# Altium schematic sheet FMC_Clocks.SchDoc
size A4; DocumentNumber: 27; SheetNumber: 27; SheetTotal: 30
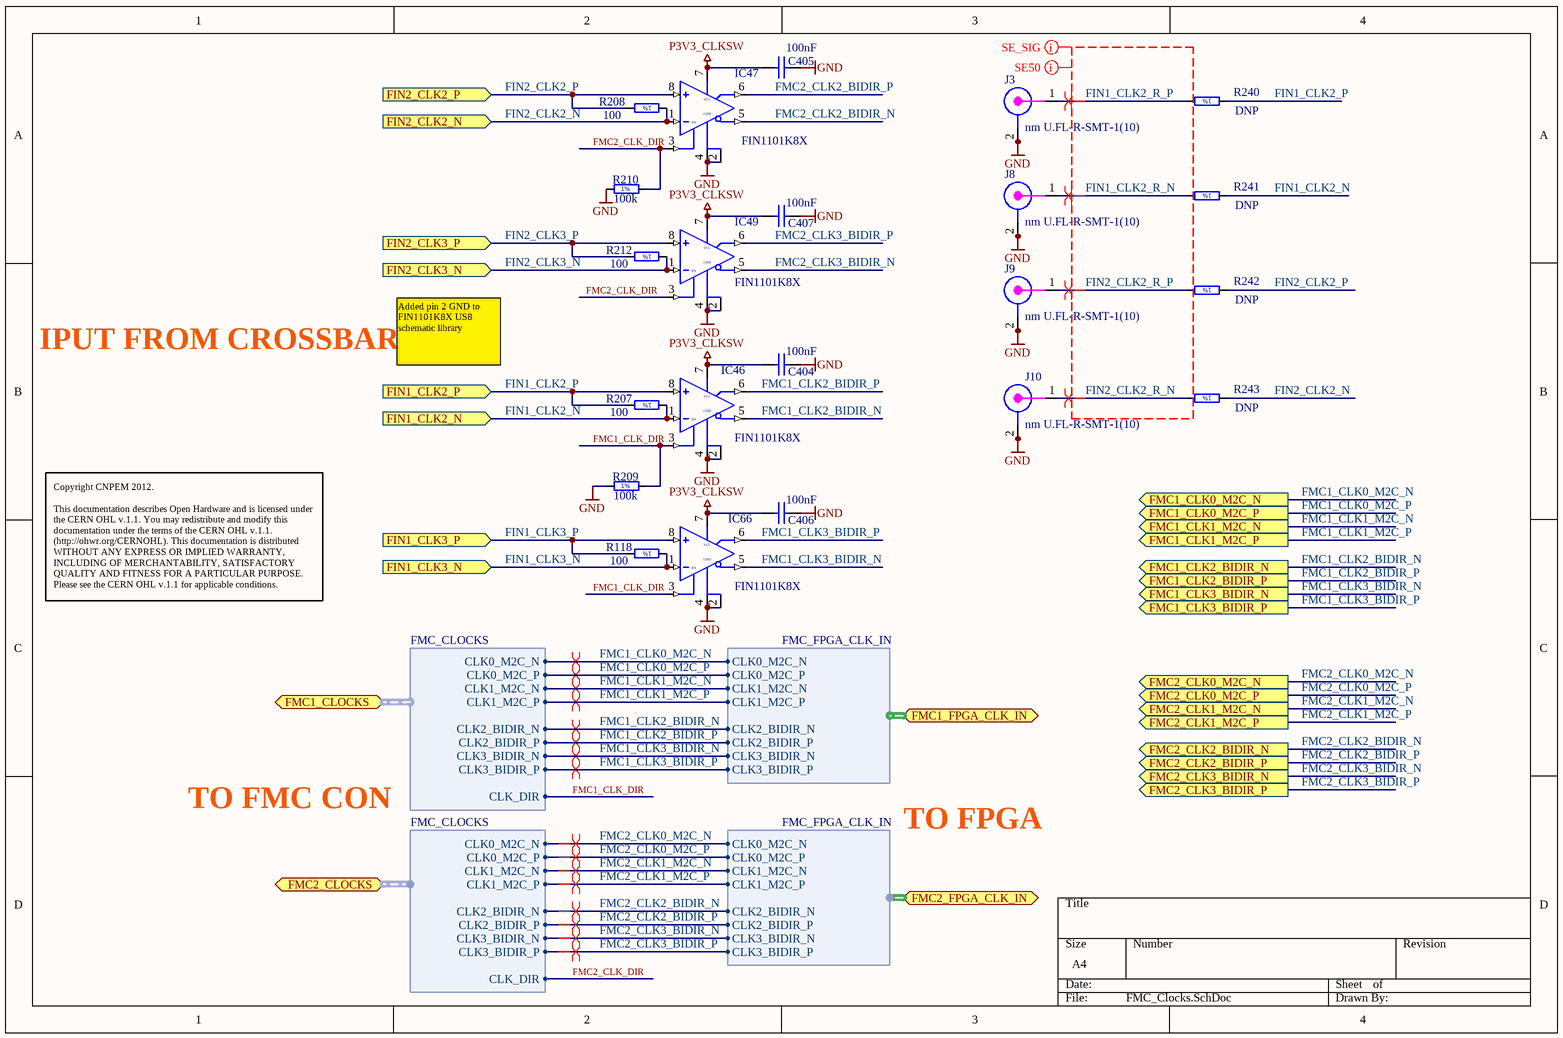
[diagram p0: FMC_Clocks.SchDoc]

## Parts
C404  100nF  [CAPC0603X33N]
C405  100nF  [CAPC0603X33N]
C406  100nF  [CAPC0603X33N]
C407  100nF  [CAPC0603X33N]
IC46  FIN1101K8X  [US8]
IC47  FIN1101K8X  [US8]
IC49  FIN1101K8X  [US8]
IC66  FIN1101K8X  [US8]
J3  nm U.FL-R-SMT-1(10)  [CON_UFL_HIROSE_RECEPTACLE]
J8  nm U.FL-R-SMT-1(10)  [CON_UFL_HIROSE_RECEPTACLE]
J9  nm U.FL-R-SMT-1(10)  [CON_UFL_HIROSE_RECEPTACLE]
J10  nm U.FL-R-SMT-1(10)  [CON_UFL_HIROSE_RECEPTACLE]
R118  100  [RESC1005X40N]
R207  100  [RESC1005X40N]
R208  100  [RESC1005X40N]
R209  100k  [RESC1005X40N]
R210  100k  [RESC1005X40N]
R212  100  [RESC1005X40N]
R240  DNP  [RESC1005X40N]
R241  DNP  [RESC1005X40N]
R242  DNP  [RESC1005X40N]
R243  DNP  [RESC1005X40N]

## Ports
FIN1_CLK2_N (in), FIN1_CLK2_P (in), FIN1_CLK3_N (in), FIN1_CLK3_P (in), FIN2_CLK2_N (in), FIN2_CLK2_P (in), FIN2_CLK3_N (in), FIN2_CLK3_P (in), FMC1_CLK0_M2C_N (out), FMC1_CLK0_M2C_P (out), FMC1_CLK1_M2C_N (out), FMC1_CLK1_M2C_P (out), FMC1_CLK2_BIDIR_N (out), FMC1_CLK2_BIDIR_P (out), FMC1_CLK3_BIDIR_N (out), FMC1_CLK3_BIDIR_P (out), FMC1_CLOCKS (harness FMC_CLOCKS), FMC1_FPGA_CLK_IN (harness FMC_FPGA_CLK_IN), FMC2_CLK0_M2C_N (out), FMC2_CLK0_M2C_P (out), FMC2_CLK1_M2C_N (out), FMC2_CLK1_M2C_P (out), FMC2_CLK2_BIDIR_N (out), FMC2_CLK2_BIDIR_P (out), FMC2_CLK3_BIDIR_N (out), FMC2_CLK3_BIDIR_P (out), FMC2_CLOCKS (harness FMC_CLOCKS), FMC2_FPGA_CLK_IN (harness FMC_FPGA_CLK_IN)

## Harnesses
FMC_CLOCKS: CLK0_M2C_N, CLK0_M2C_P, CLK1_M2C_N, CLK1_M2C_P, CLK_DIR, CLK2_BIDIR_N, CLK2_BIDIR_P, CLK3_BIDIR_N, CLK3_BIDIR_P
FMC_FPGA_CLK_IN: CLK0_M2C_N, CLK0_M2C_P, CLK1_M2C_N, CLK1_M2C_P, CLK2_BIDIR_N, CLK2_BIDIR_P, CLK3_BIDIR_N, CLK3_BIDIR_P

## Nets
GND: C404.2 C405.2 C406.2 C407.2 IC46.2(GND) IC46.4(GND) IC47.2(GND) IC47.4(GND) IC49.2(GND) IC49.4(GND) IC66.2(GND) IC66.4(GND) J3.2 J3.2a(GND) J8.2 J8.2a(GND) J9.2 J9.2a(GND) J10.2 J10.2a(GND) R209.1 R210.1
P3V3_CLKSW: C404.1 C405.1 C406.1 C407.1 IC46.7(VCC) IC47.7(VCC) IC49.7(VCC) IC66.7(VCC)
FIN1_CLK2_N: IC46.1(IN) R207.1 R241.1 ; port FIN1_CLK2_N
FIN1_CLK2_P: IC46.8(IN) R207.2 R240.1 ; port FIN1_CLK2_P
FIN1_CLK2_R_N: J8.1 R241.2
FIN1_CLK2_R_P: J3.1 R240.2
FIN1_CLK3_N: IC66.1(IN) R118.1 ; port FIN1_CLK3_N
FIN1_CLK3_P: IC66.8(IN) R118.2 ; port FIN1_CLK3_P
FIN2_CLK2_N: IC47.1(IN) R208.1 R243.1 ; port FIN2_CLK2_N
FIN2_CLK2_P: IC47.8(IN) R208.2 R242.1 ; port FIN2_CLK2_P
FIN2_CLK2_R_N: J10.1 R243.2
FIN2_CLK2_R_P: J9.1 R242.2
FIN2_CLK3_N: IC49.1(IN) R212.1 ; port FIN2_CLK3_N
FIN2_CLK3_P: IC49.8(IN) R212.2 ; port FIN2_CLK3_P
FMC1_CLK0_M2C_N: port FMC1_CLK0_M2C_N, port FMC1_CLOCKS.CLK0_M2C_N, port FMC1_FPGA_CLK_IN.CLK0_M2C_N
FMC1_CLK0_M2C_P: port FMC1_CLK0_M2C_P, port FMC1_CLOCKS.CLK0_M2C_P, port FMC1_FPGA_CLK_IN.CLK0_M2C_P
FMC1_CLK1_M2C_N: port FMC1_CLK1_M2C_N, port FMC1_CLOCKS.CLK1_M2C_N, port FMC1_FPGA_CLK_IN.CLK1_M2C_N
FMC1_CLK1_M2C_P: port FMC1_CLK1_M2C_P, port FMC1_CLOCKS.CLK1_M2C_P, port FMC1_FPGA_CLK_IN.CLK1_M2C_P
FMC1_CLK2_BIDIR_N: IC46.5(~{Q}) ; port FMC1_CLK2_BIDIR_N, port FMC1_CLOCKS.CLK2_BIDIR_N, port FMC1_FPGA_CLK_IN.CLK2_BIDIR_N
FMC1_CLK2_BIDIR_P: IC46.6(Q) ; port FMC1_CLK2_BIDIR_P, port FMC1_CLOCKS.CLK2_BIDIR_P, port FMC1_FPGA_CLK_IN.CLK2_BIDIR_P
FMC1_CLK3_BIDIR_N: IC66.5(~{Q}) ; port FMC1_CLK3_BIDIR_N, port FMC1_CLOCKS.CLK3_BIDIR_N, port FMC1_FPGA_CLK_IN.CLK3_BIDIR_N
FMC1_CLK3_BIDIR_P: IC66.6(Q) ; port FMC1_CLK3_BIDIR_P, port FMC1_CLOCKS.CLK3_BIDIR_P, port FMC1_FPGA_CLK_IN.CLK3_BIDIR_P
FMC1_CLK_DIR: IC46.3(EN) IC66.3(EN) R209.2 ; port FMC1_CLOCKS.CLK_DIR
FMC2_CLK0_M2C_N: port FMC2_CLK0_M2C_N, port FMC2_CLOCKS.CLK0_M2C_N, port FMC2_FPGA_CLK_IN.CLK0_M2C_N
FMC2_CLK0_M2C_P: port FMC2_CLK0_M2C_P, port FMC2_CLOCKS.CLK0_M2C_P, port FMC2_FPGA_CLK_IN.CLK0_M2C_P
FMC2_CLK1_M2C_N: port FMC2_CLK1_M2C_N, port FMC2_CLOCKS.CLK1_M2C_N, port FMC2_FPGA_CLK_IN.CLK1_M2C_N
FMC2_CLK1_M2C_P: port FMC2_CLK1_M2C_P, port FMC2_CLOCKS.CLK1_M2C_P, port FMC2_FPGA_CLK_IN.CLK1_M2C_P
FMC2_CLK2_BIDIR_N: IC47.5(~{Q}) ; port FMC2_CLK2_BIDIR_N, port FMC2_CLOCKS.CLK2_BIDIR_N, port FMC2_FPGA_CLK_IN.CLK2_BIDIR_N
FMC2_CLK2_BIDIR_P: IC47.6(Q) ; port FMC2_CLK2_BIDIR_P, port FMC2_CLOCKS.CLK2_BIDIR_P, port FMC2_FPGA_CLK_IN.CLK2_BIDIR_P
FMC2_CLK3_BIDIR_N: IC49.5(~{Q}) ; port FMC2_CLK3_BIDIR_N, port FMC2_CLOCKS.CLK3_BIDIR_N, port FMC2_FPGA_CLK_IN.CLK3_BIDIR_N
FMC2_CLK3_BIDIR_P: IC49.6(Q) ; port FMC2_CLK3_BIDIR_P, port FMC2_CLOCKS.CLK3_BIDIR_P, port FMC2_FPGA_CLK_IN.CLK3_BIDIR_P
FMC2_CLK_DIR: IC47.3(EN) IC49.3(EN) R210.2 ; port FMC2_CLOCKS.CLK_DIR

## Layout directives
differential pair: FIN1_CLK2_R_N, FIN1_CLK2_R_P, FIN2_CLK2_R_N, FIN2_CLK2_R_P, FMC1_CLK0_M2C_N, FMC1_CLK0_M2C_P, FMC1_CLK1_M2C_N, FMC1_CLK1_M2C_P, FMC1_CLK2_BIDIR_N, FMC1_CLK2_BIDIR_P, FMC1_CLK3_BIDIR_N, FMC1_CLK3_BIDIR_P, FMC2_CLK0_M2C_N, FMC2_CLK0_M2C_P, FMC2_CLK1_M2C_N, FMC2_CLK1_M2C_P, FMC2_CLK2_BIDIR_N, FMC2_CLK2_BIDIR_P, FMC2_CLK3_BIDIR_N, FMC2_CLK3_BIDIR_P
net class SE_SIG: FIN1_CLK2_R_N, FIN1_CLK2_R_P, FIN2_CLK2_R_N, FIN2_CLK2_R_P
net class SE50: FIN1_CLK2_R_N, FIN1_CLK2_R_P, FIN2_CLK2_R_N, FIN2_CLK2_R_P

## Notes on the sheet
- IPUT FROM CROSSBAR
- Added pin 2 GND to FIN1101K8X US8 schematic library
- Copyright CNPEM 2012.
  This documentation describes Open Hardware and is licensed under the CERN OHL v.1.1. You may redistribute and modify this documentation under the terms of the CERN OHL v.1.1. (http://ohwr.org/CERNOHL). This documentation is distributed WITHOUT ANY EXPRESS OR IMPLIED WARRANTY, INCLUDING OF MERCHANTABILITY, SATISFACTORY QUALITY AND FITNESS FOR A PARTICULAR PURPOSE. Please see the CERN OHL v.1.1 for applicable conditions.
- TO FMC CON
- TO FPGA
- (in symbol R0402_0R_JUMPER) 1%
- (in symbol R0402_100K_1%_0.0625W_100PPM) 1%
- (in symbol R0402_100R_1%_0.0625W_100PPM) 1%

## Library data of the parts
C404-C407 = CC0201_100NF_6.3V_10%_X5R: Non-polarised capacitor; Part Description: SMD Multilayer Chip Ceramic Capacitor; Manufacturer: GENERIC; Manufacturer1 Part Number: 02016D104KAT2A; Voltage: 6.3V; TC: X5R; Tolerance: ±10%; Table: Capacitors SMD; Part Number: CC0201_100NF_6.3V_10%_X5R; Component Kind: Standard; Component Type: Standard; Pin Count: 2; Value: 100nF; Status: Not Recommended; Manufacturer Part Number: CC0201_100NF_6.3V_10%_X5R; Case: 0201; Mounted: Yes; Socket: No; SMD: Yes; Manufacturer1 Example: AVX; Manufacturer1 ComponentHeight: 0.33mm; HelpURL: \\cern.ch\dfs\Applications\Altium\Datasheets\CC0201_X5R_AVX.pdf; Author: CERN DEM JLC; CreateDate: 2007-12-03; LatestRevisionDate: 2007-12-03
IC46 IC47 IC49 IC66 = IFC_FIN1101K8X: LVDS TO LVDS repeater3.3V
J3 J8-J10 = CON_UFL_SMD: UFL; Supplier 1: Newark; Supplier Part Number 1: 50P8856
R118 R207 R208 R212 = R0402_100R_1%_0.0625W_100PPM: Resistor - 1%; Part Description: General Purpose Thick Film Chip Resistor; Manufacturer: GENERIC; Manufacturer1 Part Number: 232270671001L; TC: ±100ppm/°C; Table: Resistors SMD; Part Number: R0402_100R_1%_0.0625W_100PPM; Component Kind: Standard; Component Type: Standard; Pin Count: 2; Value: 100; Status: Not recommended; Power: 0.0625W; Tolerance: ±1%; Manufacturer Part Number: R0402_100R_1%_0.0625W_100PPM; Case: 0402; Mounted: Yes; Socket: No; SMD: Yes; Manufacturer1 Example: YAGEO PHYCOMP; Manufacturer1 ComponentHeight: 0.4mm; HelpURL: \\cern.ch\dfs\Applications\Altium\Datasheets\R0402_Phycomp_RC0402.pdf; Author: CERN DEM JLC; CreateDate: 2007-12-03; LatestRevisionDate: 2012-10-17
R209 R210 = R0402_100K_1%_0.0625W_100PPM: Resistor - 1%; Part Description: General Purpose Thick Film Chip Resistor; Manufacturer: GENERIC; Manufacturer1 Part Number: 232270671004L; TC: ±100ppm/°C; Table: Resistors SMD; Part Number: R0402_100K_1%_0.0625W_100PPM; Component Kind: Standard; Component Type: Standard; Pin Count: 2; Value: 100k; Status: Not recommended; Power: 0.0625W; Tolerance: ±1%; Manufacturer Part Number: R0402_100K_1%_0.0625W_100PPM; Case: 0402; Mounted: Yes; Socket: No; SMD: Yes; Manufacturer1 Example: YAGEO PHYCOMP; Manufacturer1 ComponentHeight: 0.4mm; HelpURL: \\cern.ch\dfs\Applications\Altium\Datasheets\R0402_Phycomp_RC0402.pdf; Author: CERN DEM JLC; CreateDate: 2007-12-03; LatestRevisionDate: 2012-10-17
R240-R243 = R0402_0R_JUMPER: Resistor - 1%; Part Description: 1A (0.05R Max DC Resistance) Zero Ohm Jumper; Manufacturer: GENERIC; Manufacturer1 Part Number: 232270591001L; Value: 0; Table: Resistors SMD; Part Number: R0402_0R_JUMPER; Component Kind: Standard; Component Type: Standard; Pin Count: 2; Status: Not recommended; Manufacturer Part Number: R0402_0R_JUMPER; Case: 0402; Mounted: Yes; Socket: No; SMD: Yes; Manufacturer1 Example: YAGEO PHYCOMP; Manufacturer1 ComponentHeight: 0.4mm; HelpURL: \\cern.ch\dfs\Applications\Altium\Datasheets\R0402_Phycomp_RC0402.pdf; Author: CERN DEM JLC; CreateDate: 2007-12-03; LatestRevisionDate: 2012-10-17